# Altium schematic sheet 4_DDR PHY.schdoc
size 431 x 309 mm; Symbol: Sheet-Symbol_A4; Device: Sheet-Symbol_A4; Company: 嘉立创EDA; Version: V1.0; Page Size: A4; @Project Name: RK3568核心板; @Page Count: 13; @Update Date: 2024-10-10; @Create Date: 2024-10-09; @Schematic Name: Schematic1; @Page No: 3; @Page Name: DDR PHY; @Board Name: Board1; @Create Time: 14:27:15; @Update Time: 09:52:56; Width: 1655; Height: 1170; Region Start: 1; X Region Count: 6; Y Region Count: 4; Blade Width: 10; Title Block Position: 3
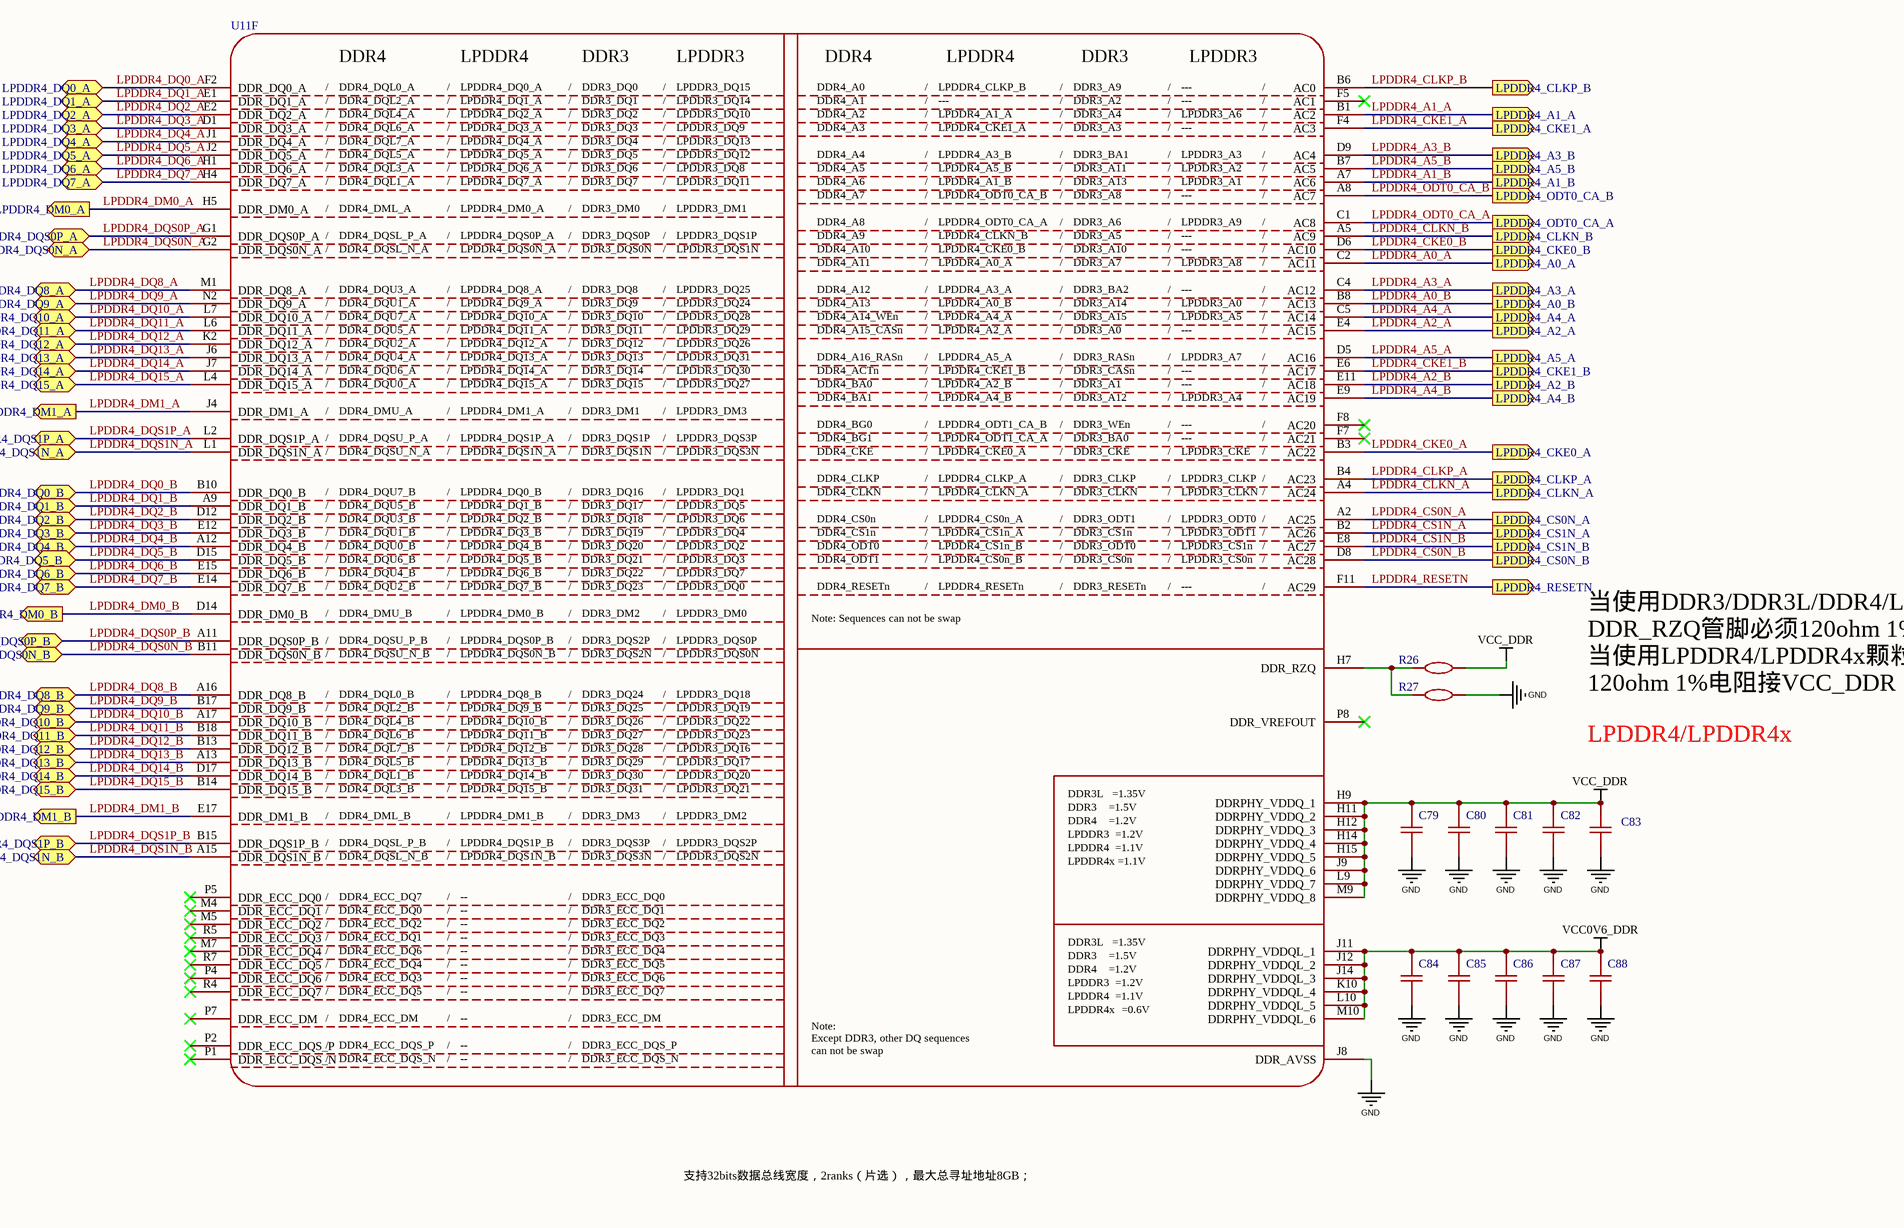
[diagram p0: 4_DDR PHY.schdoc]

## Parts
C79  100nF  [C0201]  (value not drawn)
C80  100nF  [C0201]  (value not drawn)
C81  4.7uF  [C0201]  (value not drawn)
C82  4.7uF  [C0201]  (value not drawn)
C83  10uF  [C0402]  (value not drawn)
C84  100nF  [C0201]  (value not drawn)
C85  100nF  [C0201]  (value not drawn)
C86  4.7uF  [C0201]  (value not drawn)
C87  4.7uF  [C0201]  (value not drawn)
C88  4.7uF  [C0201]  (value not drawn)
R26  120Ω  [R0402]  (value not drawn)
R27  NC  [R0402]  (value not drawn)
U11  SOC_RK3568  [RK3568]  (value not drawn)  (part F of 23)

## Ports
LPDDR4_A0_A (out), LPDDR4_A0_B (out), LPDDR4_A1_A (out), LPDDR4_A1_B (out), LPDDR4_A2_A (out), LPDDR4_A2_B (out), LPDDR4_A3_A (out), LPDDR4_A3_B (out), LPDDR4_A4_A (out), LPDDR4_A4_B (out), LPDDR4_A5_A (out), LPDDR4_A5_B (out), LPDDR4_CKE0_A (out), LPDDR4_CKE0_B (out), LPDDR4_CKE1_A (out), LPDDR4_CKE1_B (out), LPDDR4_CLKN_A (out), LPDDR4_CLKN_B (out), LPDDR4_CLKP_A (out), LPDDR4_CLKP_B (out), LPDDR4_CS0N_A (out), LPDDR4_CS0N_B (out), LPDDR4_CS1N_A (out), LPDDR4_CS1N_B (out), LPDDR4_DM0_A (out), LPDDR4_DM0_B (out), LPDDR4_DM1_A (out), LPDDR4_DM1_B (out), LPDDR4_DQ0_A (bidir), LPDDR4_DQ0_B (bidir), LPDDR4_DQ1_A (bidir), LPDDR4_DQ1_B (bidir), LPDDR4_DQ2_A (bidir), LPDDR4_DQ2_B (bidir), LPDDR4_DQ3_A (bidir), LPDDR4_DQ3_B (bidir), LPDDR4_DQ4_A (bidir), LPDDR4_DQ4_B (bidir), LPDDR4_DQ5_A (bidir), LPDDR4_DQ5_B (bidir), LPDDR4_DQ6_A (bidir), LPDDR4_DQ6_B (bidir), LPDDR4_DQ7_A (bidir), LPDDR4_DQ7_B (bidir), LPDDR4_DQ8_A (bidir), LPDDR4_DQ8_B (bidir), LPDDR4_DQ9_A (bidir), LPDDR4_DQ9_B (bidir), LPDDR4_DQ10_A (bidir), LPDDR4_DQ10_B (bidir), LPDDR4_DQ11_A (bidir), LPDDR4_DQ11_B (bidir), LPDDR4_DQ12_A (bidir), LPDDR4_DQ12_B (bidir), LPDDR4_DQ13_A (bidir), LPDDR4_DQ13_B (bidir), LPDDR4_DQ14_A (bidir), LPDDR4_DQ14_B (bidir), LPDDR4_DQ15_A (bidir), LPDDR4_DQ15_B (bidir), LPDDR4_DQS0N_A (bidir), LPDDR4_DQS0N_B (bidir), LPDDR4_DQS0P_A (bidir), LPDDR4_DQS0P_B (bidir), LPDDR4_DQS1N_A (bidir), LPDDR4_DQS1N_B (bidir), LPDDR4_DQS1P_A (bidir), LPDDR4_DQS1P_B (bidir), LPDDR4_ODT0_CA_A (out), LPDDR4_ODT0_CA_B (out), LPDDR4_RESETN (out)

## Nets
GND: C79.1 C80.1 C81.1 C82.1 C83.1 C84.1 C85.1 C86.1 C87.1 C88.1 R27.2 U11.J8(DDR_AVSS)
VCC0V6_DDR: C84.2 C85.2 C86.2 C87.2 C88.2 U11.J11(DDRPHY_VDDQL_1) U11.J12(DDRPHY_VDDQL_2) U11.J14(DDRPHY_VDDQL_3) U11.K10(DDRPHY_VDDQL_4) U11.L10(DDRPHY_VDDQL_5) U11.M10(DDRPHY_VDDQL_6)
VCC_DDR: C79.2 C80.2 C81.2 C82.2 C83.2 R26.2 U11.H9(DDRPHY_VDDQ_1) U11.H11(DDRPHY_VDDQ_2) U11.H12(DDRPHY_VDDQ_3) U11.H14(DDRPHY_VDDQ_4) U11.H15(DDRPHY_VDDQ_5) U11.J9(DDRPHY_VDDQ_6) U11.L9(DDRPHY_VDDQ_7) U11.M9(DDRPHY_VDDQ_8)
LPDDR4_A0_A: U11.C2(AC11) ; port LPDDR4_A0_A
LPDDR4_A0_B: U11.B8(AC13) ; port LPDDR4_A0_B
LPDDR4_A1_A: U11.B1(AC2) ; port LPDDR4_A1_A
LPDDR4_A1_B: U11.A7(AC6) ; port LPDDR4_A1_B
LPDDR4_A2_A: U11.E4(AC15) ; port LPDDR4_A2_A
LPDDR4_A2_B: U11.E11(AC18) ; port LPDDR4_A2_B
LPDDR4_A3_A: U11.C4(AC12) ; port LPDDR4_A3_A
LPDDR4_A3_B: U11.D9(AC4) ; port LPDDR4_A3_B
LPDDR4_A4_A: U11.C5(AC14) ; port LPDDR4_A4_A
LPDDR4_A4_B: U11.E9(AC19) ; port LPDDR4_A4_B
LPDDR4_A5_A: U11.D5(AC16) ; port LPDDR4_A5_A
LPDDR4_A5_B: U11.B7(AC5) ; port LPDDR4_A5_B
LPDDR4_CKE0_A: U11.B3(AC22) ; port LPDDR4_CKE0_A
LPDDR4_CKE0_B: U11.D6(AC10) ; port LPDDR4_CKE0_B
LPDDR4_CKE1_A: U11.F4(AC3) ; port LPDDR4_CKE1_A
LPDDR4_CKE1_B: U11.E6(AC17) ; port LPDDR4_CKE1_B
LPDDR4_CLKN_A: U11.A4(AC24) ; port LPDDR4_CLKN_A
LPDDR4_CLKN_B: U11.A5(AC9) ; port LPDDR4_CLKN_B
LPDDR4_CLKP_A: U11.B4(AC23) ; port LPDDR4_CLKP_A
LPDDR4_CLKP_B: U11.B6(AC0) ; port LPDDR4_CLKP_B
LPDDR4_CS0N_A: U11.A2(AC25) ; port LPDDR4_CS0N_A
LPDDR4_CS0N_B: U11.D8(AC28) ; port LPDDR4_CS0N_B
LPDDR4_CS1N_A: U11.B2(AC26) ; port LPDDR4_CS1N_A
LPDDR4_CS1N_B: U11.E8(AC27) ; port LPDDR4_CS1N_B
LPDDR4_DM0_A: U11.H5(DDR_DM0_A) ; port LPDDR4_DM0_A
LPDDR4_DM0_B: U11.D14(DDR_DM0_B) ; port LPDDR4_DM0_B
LPDDR4_DM1_A: U11.J4(DDR_DM1_A) ; port LPDDR4_DM1_A
LPDDR4_DM1_B: U11.E17(DDR_DM1_B) ; port LPDDR4_DM1_B
LPDDR4_DQ0_A: U11.F2(DDR_DQ0_A) ; port LPDDR4_DQ0_A
LPDDR4_DQ0_B: U11.B10(DDR_DQ0_B) ; port LPDDR4_DQ0_B
LPDDR4_DQ1_A: U11.E1(DDR_DQ1_A) ; port LPDDR4_DQ1_A
LPDDR4_DQ1_B: U11.A9(DDR_DQ1_B) ; port LPDDR4_DQ1_B
LPDDR4_DQ2_A: U11.E2(DDR_DQ2_A) ; port LPDDR4_DQ2_A
LPDDR4_DQ2_B: U11.D12(DDR_DQ2_B) ; port LPDDR4_DQ2_B
LPDDR4_DQ3_A: U11.D1(DDR_DQ3_A) ; port LPDDR4_DQ3_A
LPDDR4_DQ3_B: U11.E12(DDR_DQ3_B) ; port LPDDR4_DQ3_B
LPDDR4_DQ4_A: U11.J1(DDR_DQ4_A) ; port LPDDR4_DQ4_A
LPDDR4_DQ4_B: U11.A12(DDR_DQ4_B) ; port LPDDR4_DQ4_B
LPDDR4_DQ5_A: U11.J2(DDR_DQ5_A) ; port LPDDR4_DQ5_A
LPDDR4_DQ5_B: U11.D15(DDR_DQ5_B) ; port LPDDR4_DQ5_B
LPDDR4_DQ6_A: U11.H1(DDR_DQ6_A) ; port LPDDR4_DQ6_A
LPDDR4_DQ6_B: U11.E15(DDR_DQ6_B) ; port LPDDR4_DQ6_B
LPDDR4_DQ7_A: U11.H4(DDR_DQ7_A) ; port LPDDR4_DQ7_A
LPDDR4_DQ7_B: U11.E14(DDR_DQ7_B) ; port LPDDR4_DQ7_B
LPDDR4_DQ8_A: U11.M1(DDR_DQ8_A) ; port LPDDR4_DQ8_A
LPDDR4_DQ8_B: U11.A16(DDR_DQ8_B) ; port LPDDR4_DQ8_B
LPDDR4_DQ9_A: U11.N2(DDR_DQ9_A) ; port LPDDR4_DQ9_A
LPDDR4_DQ9_B: U11.B17(DDR_DQ9_B) ; port LPDDR4_DQ9_B
LPDDR4_DQ10_A: U11.L7(DDR_DQ10_A) ; port LPDDR4_DQ10_A
LPDDR4_DQ10_B: U11.A17(DDR_DQ10_B) ; port LPDDR4_DQ10_B
LPDDR4_DQ11_A: U11.L6(DDR_DQ11_A) ; port LPDDR4_DQ11_A
LPDDR4_DQ11_B: U11.B18(DDR_DQ11_B) ; port LPDDR4_DQ11_B
LPDDR4_DQ12_A: U11.K2(DDR_DQ12_A) ; port LPDDR4_DQ12_A
LPDDR4_DQ12_B: U11.B13(DDR_DQ12_B) ; port LPDDR4_DQ12_B
LPDDR4_DQ13_A: U11.J6(DDR_DQ13_A) ; port LPDDR4_DQ13_A
LPDDR4_DQ13_B: U11.A13(DDR_DQ13_B) ; port LPDDR4_DQ13_B
LPDDR4_DQ14_A: U11.J7(DDR_DQ14_A) ; port LPDDR4_DQ14_A
LPDDR4_DQ14_B: U11.D17(DDR_DQ14_B) ; port LPDDR4_DQ14_B
LPDDR4_DQ15_A: U11.L4(DDR_DQ15_A) ; port LPDDR4_DQ15_A
LPDDR4_DQ15_B: U11.B14(DDR_DQ15_B) ; port LPDDR4_DQ15_B
LPDDR4_DQS0N_A: U11.G2(DDR_DQS0N_A) ; port LPDDR4_DQS0N_A
LPDDR4_DQS0N_B: U11.B11(DDR_DQS0N_B) ; port LPDDR4_DQS0N_B
LPDDR4_DQS0P_A: U11.G1(DDR_DQS0P_A) ; port LPDDR4_DQS0P_A
LPDDR4_DQS0P_B: U11.A11(DDR_DQS0P_B) ; port LPDDR4_DQS0P_B
LPDDR4_DQS1N_A: U11.L1(DDR_DQS1N_A) ; port LPDDR4_DQS1N_A
LPDDR4_DQS1N_B: U11.A15(DDR_DQS1N_B) ; port LPDDR4_DQS1N_B
LPDDR4_DQS1P_A: U11.L2(DDR_DQS1P_A) ; port LPDDR4_DQS1P_A
LPDDR4_DQS1P_B: U11.B15(DDR_DQS1P_B) ; port LPDDR4_DQS1P_B
LPDDR4_ODT0_CA_A: U11.C1(AC8) ; port LPDDR4_ODT0_CA_A
LPDDR4_ODT0_CA_B: U11.A8(AC7) ; port LPDDR4_ODT0_CA_B
LPDDR4_RESETN: U11.F11(AC29) ; port LPDDR4_RESETN
NetR26_1: R26.1 R27.1 U11.H7(DDR_RZQ)

Not connected (* = marked no-connect by the designer): U11 F5(AC1)* F7(AC21)* F8(AC20)* M4(DDR_ECC_DQ1)* M5(DDR_ECC_DQ2)* M7(DDR_ECC_DQ4)* P1(DDR_ECC_DQS_N)* P2(DDR_ECC_DQS_P)* P4(DDR_ECC_DQ6)* P5(DDR_ECC_DQ0)* P7(DDR_ECC_DM)* P8(DDR_VREFOUT)* R4(DDR_ECC_DQ7)* R5(DDR_ECC_DQ3)* R7(DDR_ECC_DQ5)*

## Notes on the sheet
- LPDDR4/LPDDR4x
- 当使用DDR3/DDR3L/DDR4/LPDDR3颗粒时，
  DDR_RZQ管脚必须120ohm 1%电阻接地
  当使用LPDDR4/LPDDR4x颗粒时，
  120ohm 1%电阻接VCC_DDR
- 支持32bits数据总线宽度，2ranks（片选），最大总寻址地址8GB；
- 1
- 2
- 3
- 4
- 5
- 6
- A
- B
- C
- D
- 原理图
- Schematic1
- 创建日期
- 更新日期
- 2024-10-10
- 2024-10-09
- 审阅
- 绘制
- 图页
- DDR PHY
- 物料编码
- RK3568核心板
- 版本
- 尺寸
- 页
- 共
- 13
- V1.0
- A4
- 嘉立创EDA
- (in symbol SOC_RK3568, part F) DDR4; LPDDR4; DDR3; LPDDR3; /; DDR4_DQL0_A; LPDDR4_DQ0_A; DDR3_DQ0; LPDDR3_DQ15; DDR4_A0; LPDDR4_CLKP_B; DDR3_A9; ---; DDR4_DQL2_A; LPDDR4_DQ1_A; DDR3_DQ1; LPDDR3_DQ14; DDR4_A1; DDR3_A2; DDR4_DQL4_A; LPDDR4_DQ2_A; DDR3_DQ2; LPDDR3_DQ10; DDR4_A2; LPDDR4_A1_A; DDR3_A4; LPDDR3_A6; DDR4_DQL6_A; LPDDR4_DQ3_A; DDR3_DQ3; LPDDR3_DQ9; DDR4_A3; LPDDR4_CKE1_A; DDR3_A3; DDR4_DQL7_A; LPDDR4_DQ4_A; DDR3_DQ4; LPDDR3_DQ13; DDR4_DQL5_A; LPDDR4_DQ5_A; DDR3_DQ5; LPDDR3_DQ12; DDR4_A4; LPDDR4_A3_B; DDR3_BA1; LPDDR3_A3; DDR4_DQL3_A; LPDDR4_DQ6_A; DDR3_DQ6; LPDDR3_DQ8; DDR4_A5; LPDDR4_A5_B; DDR3_A11; LPDDR3_A2; DDR4_DQL1_A; LPDDR4_DQ7_A; DDR3_DQ7; LPDDR3_DQ11; DDR4_A6; LPDDR4_A1_B; DDR3_A13; LPDDR3_A1; DDR4_A7; LPDDR4_ODT0_CA_B; DDR3_A8; DDR4_DML_A; LPDDR4_DM0_A; DDR3_DM0; LPDDR3_DM1; DDR4_A8; LPDDR4_ODT0_CA_A; DDR3_A6; LPDDR3_A9; DDR4_DQSL_P_A; LPDDR4_DQS0P_A; DDR3_DQS0P; LPDDR3_DQS1P; DDR4_A9; LPDDR4_CLKN_B; DDR3_A5; DDR4_DQSL_N_A; LPDDR4_DQS0N_A; DDR3_DQS0N; LPDDR3_DQS1N; DDR4_A10; LPDDR4_CKE0_B; DDR3_A10; DDR4_A11; LPDDR4_A0_A; DDR3_A7; LPDDR3_A8; DDR4_DQU3_A; LPDDR4_DQ8_A; DDR3_DQ8; LPDDR3_DQ25; DDR4_A12; LPDDR4_A3_A; DDR3_BA2; DDR4_DQU1_A; LPDDR4_DQ9_A; DDR3_DQ9; LPDDR3_DQ24; DDR4_A13; LPDDR4_A0_B; DDR3_A14; LPDDR3_A0; DDR4_DQU7_A; LPDDR4_DQ10_A; DDR3_DQ10; LPDDR3_DQ28; DDR4_A14_WEn; LPDDR4_A4_A; DDR3_A15; LPDDR3_A5; DDR4_DQU5_A; LPDDR4_DQ11_A; DDR3_DQ11; LPDDR3_DQ29; DDR4_A15_CASn; LPDDR4_A2_A; DDR3_A0; DDR4_DQU2_A; LPDDR4_DQ12_A; DDR3_DQ12; LPDDR3_DQ26; DDR4_DQU4_A; LPDDR4_DQ13_A; DDR3_DQ13; LPDDR3_DQ31; DDR4_A16_RASn; LPDDR4_A5_A; DDR3_RASn; LPDDR3_A7; DDR4_DQU6_A; LPDDR4_DQ14_A; DDR3_DQ14; LPDDR3_DQ30; DDR4_ACTn; LPDDR4_CKE1_B; DDR3_CASn; DDR4_DQU0_A; LPDDR4_DQ15_A; DDR3_DQ15; LPDDR3_DQ27; DDR4_BA0; LPDDR4_A2_B; DDR3_A1; DDR4_BA1; LPDDR4_A4_B; DDR3_A12; LPDDR3_A4; DDR4_DMU_A; LPDDR4_DM1_A; DDR3_DM1; LPDDR3_DM3; DDR4_BG0; LPDDR4_ODT1_CA_B; DDR3_WEn; DDR4_DQSU_P_A; LPDDR4_DQS1P_A; DDR3_DQS1P; LPDDR3_DQS3P; DDR4_BG1; LPDDR4_ODT1_CA_A; DDR3_BA0; DDR4_DQSU_N_A; LPDDR4_DQS1N_A; DDR3_DQS1N; LPDDR3_DQS3N; DDR4_CKE; LPDDR4_CKE0_A; DDR3_CKE; LPDDR3_CKE; DDR4_CLKP; LPDDR4_CLKP_A; DDR3_CLKP; LPDDR3_CLKP; DDR4_DQU7_B; LPDDR4_DQ0_B; DDR3_DQ16; LPDDR3_DQ1; DDR4_CLKN; LPDDR4_CLKN_A; DDR3_CLKN; LPDDR3_CLKN; DDR4_DQU5_B; LPDDR4_DQ1_B; DDR3_DQ17; LPDDR3_DQ5; DDR4_DQU3_B; LPDDR4_DQ2_B; DDR3_DQ18; LPDDR3_DQ6; DDR4_CS0n; LPDDR4_CS0n_A; DDR3_ODT1; LPDDR3_ODT0; DDR4_DQU1_B; LPDDR4_DQ3_B; DDR3_DQ19; LPDDR3_DQ4; DDR4_CS1n; LPDDR4_CS1n_A; DDR3_CS1n; LPDDR3_ODT1; DDR4_DQU0_B; LPDDR4_DQ4_B; DDR3_DQ20; LPDDR3_DQ2; DDR4_ODT0; LPDDR4_CS1n_B; DDR3_ODT0; LPDDR3_CS1n; DDR4_DQU6_B; LPDDR4_DQ5_B; DDR3_DQ21; LPDDR3_DQ3; DDR4_ODT1; LPDDR4_CS0n_B; DDR3_CS0n; LPDDR3_CS0n; DDR4_DQU4_B; LPDDR4_DQ6_B; DDR3_DQ22; LPDDR3_DQ7; DDR4_DQU2_B; LPDDR4_DQ7_B; DDR3_DQ23; LPDDR3_DQ0; DDR4_RESETn; LPDDR4_RESETn; DDR3_RESETn; DDR4_DMU_B; LPDDR4_DM0_B; DDR3_DM2; LPDDR3_DM0; Note: Sequences can not be swap; DDR4_DQSU_P_B; LPDDR4_DQS0P_B; DDR3_DQS2P; LPDDR3_DQS0P; DDR4_DQSU_N_B; LPDDR4_DQS0N_B; DDR3_DQS2N; LPDDR3_DQS0N; DDR4_DQL0_B; LPDDR4_DQ8_B; DDR3_DQ24; LPDDR3_DQ18; DDR4_DQL2_B; LPDDR4_DQ9_B; DDR3_DQ25; LPDDR3_DQ19; DDR4_DQL4_B; LPDDR4_DQ10_B; DDR3_DQ26; LPDDR3_DQ22; DDR4_DQL6_B; LPDDR4_DQ11_B; DDR3_DQ27; LPDDR3_DQ23; DDR4_DQL7_B; LPDDR4_DQ12_B; DDR3_DQ28; LPDDR3_DQ16; DDR4_DQL5_B; LPDDR4_DQ13_B; DDR3_DQ29; LPDDR3_DQ17; DDR4_DQL1_B; LPDDR4_DQ14_B; DDR3_DQ30; LPDDR3_DQ20; DDR4_DQL3_B; LPDDR4_DQ15_B; DDR3_DQ31; LPDDR3_DQ21; DDR3L   =1.35V; DDR3    =1.5V; DDR4_DML_B; LPDDR4_DM1_B; DDR3_DM3; LPDDR3_DM2; DDR4    =1.2V; LPDDR3  =1.2V; DDR4_DQSL_P_B; LPDDR4_DQS1P_B; DDR3_DQS3P; LPDDR3_DQS2P; LPDDR4  =1.1V; DDR4_DQSL_N_B; LPDDR4_DQS1N_B; DDR3_DQS3N; LPDDR3_DQS2N; LPDDR4x =1.1V; DDR4_ECC_DQ7; --; DDR3_ECC_DQ0; DDR4_ECC_DQ0; DDR3_ECC_DQ1; DDR4_ECC_DQ2; DDR3_ECC_DQ2; DDR4_ECC_DQ1; DDR3_ECC_DQ3; DDR4_ECC_DQ6; DDR3_ECC_DQ4; DDR4_ECC_DQ4; DDR3_ECC_DQ5; DDR4_ECC_DQ3; DDR3_ECC_DQ6; DDR4_ECC_DQ5; DDR3_ECC_DQ7; LPDDR4x; DDR4_ECC_DM; DDR3_ECC_DM; DDR4_ECC_DQS_P; DDR3_ECC_DQS_P; DDR4_ECC_DQS_N; DDR3_ECC_DQS_N; Note: / Except DDR3, other DQ sequences / can not be swap

## Library data of the parts
C79 C80 C84 C85 = CL03A104KO3NNNC: 容值:100nF;精度:±10%;额定电压:16V;材质(温度系数):X5R;; Manufacturer: SAMSUNG(三星); Add into BOM: yes; Tolerance: ±10%; Voltage Rated: 16V; Temperature Coefficient: X5R; Symbol: CL03A104KO3NNNC; Device: CL03A104KO3NNNC; LCSC Part Name: 100nF ±10% 16V; Supplier Part: C307380; Manufacturer Part: CL03A104KO3NNNC; Supplier Footprint: 0201; JLCPCB Part Class: 扩展库; Datasheet: https://atta.szlcsc.com/upload/public/pdf/source/20160218/1457707763339.pdf; Supplier: LCSC; Convert to PCB: yes; Value: 100nF
C81 C82 C86-C88 = GRM035R60J475ME15D: 容值:4.7uF;精度:±20%;额定电压:6.3V;材质(温度系数):X5R;; Manufacturer: muRata(村田); Add into BOM: yes; Tolerance: ±20%; Voltage Rated: 6.3V; Temperature Coefficient: X5R; Symbol: GRM035R60J475ME15D; Device: GRM035R60J475ME15D; LCSC Part Name: 4.7uF ±20% 6.3V; Supplier Part: C335103; Manufacturer Part: GRM035R60J475ME15D; Supplier Footprint: 0201; JLCPCB Part Class: 扩展库; Datasheet: https://atta.szlcsc.com/upload/public/pdf/source/20200305/C490387_23319AE8C154DEB24C505E6C82A8106A.pdf; Supplier: LCSC; Convert to PCB: yes; Value: 4.7uF
C83 = CL05A106MP5NUNC: 容值:10uF;精度:±20%;额定电压:10V;材质(温度系数):X5R;; Manufacturer: SAMSUNG(三星); Symbol: CL05A106MP5NUNC_C315248; Add into BOM: yes; Tolerance: ±20%; Voltage Rated: 10V; Temperature Coefficient: X5R; Device: CL05A106MP5NUNC; LCSC Part Name: 10uF ±20% 10V; Supplier Part: C315248; Manufacturer Part: CL05A106MP5NUNC; Supplier Footprint: 0402; JLCPCB Part Class: 扩展库; Datasheet: https://atta.szlcsc.com/upload/public/pdf/source/20231220/1EF805BAE1520675928CC4638D279E74.pdf; Supplier: LCSC; Convert to PCB: yes; Value: 10uF
R26 R27 = 0402WGF1200TCE: 电阻类型:厚膜电阻;阻值:120Ω;精度:±1%;功率:62.5mW;最大工作电压:50V;温度系数:±100ppm/℃;; Manufacturer: UNI-ROYAL(厚声); Add into BOM: yes; Tolerance: ±1%; Power(Watts): 62.5mW; Overload Voltage (Max): 50V; Symbol: 0402WGF1200TCE; Device: 0402WGF1200TCE; Supplier: LCSC; Manufacturer Part: 0402WGF1200TCE; Supplier Part: C25079; JLCPCB Part Class: 基础库; LCSC Part Name: 120Ω ±1% 62.5mW 厚膜电阻; Supplier Footprint: 0402; Datasheet: https://atta.szlcsc.com/upload/public/pdf/source/20200306/C422600_1E6D84923E4A46A82E41ADD87F860B5C.pdf; Convert to PCB: yes; Type: 厚膜电阻; Temperature Coefficient: ±100ppm/℃; Operating Temperature Range: -55℃~+155℃
  R26: Value: 120Ω
  R27: Value: NC
U11 = SOC_RK3568: Part Reference: U1000; Manufacturer: Rockchip (瑞芯微); PCB footprint: BGA636_19R00X19R00X1R20; SWAP_INFO: (S1+S2+S3+S4+S5+S6+S7+S8+S9+S10+S11+S12+S13+S14+S15+S16+S17+S18+S19+S20+S21+S22+S23); SPLIT_INST: TRUE; Value: RK3568; Priority: A; Add into BOM: yes; Relevance: []; Symbol: SOC_RK3568; Device: SOC_RK3568; RK PN: RK3568; Part Type: SOC; Manufacturer PN: RK3568; Created by: JJJ; Origin Footprint 2: BGA636_19R00X19R00X1R20; Convert to PCB: yes